# Altium schematic sheet Transducer.SchDoc
size A4; Author: Esteban Durán Madrid; CompanyName: Universidad de Santiago de Chile; Address1: Avenida Ecuador Nº 3519; Address2: Estación Central, Santiago; Address3: Chile; DocumentNumber: 3; SheetNumber: 3; SheetTotal: 3
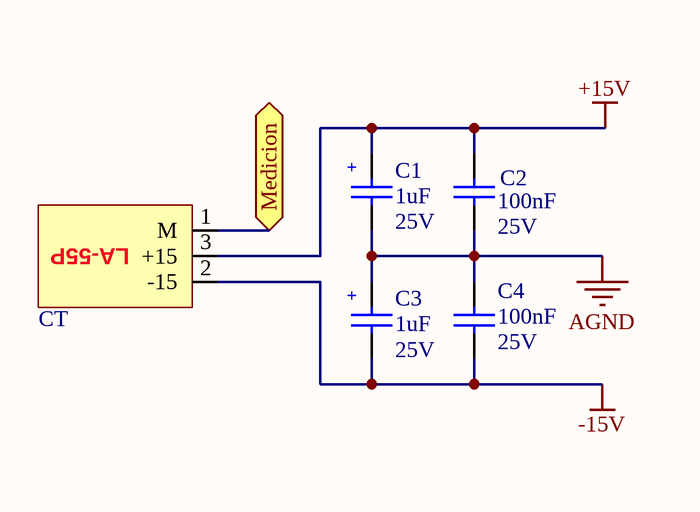
[diagram p0: Transducer.SchDoc]

## Parts
C1  1uF  Voltage: 25V  [CAP_1206 Tantalio]
C2  100nF  Voltage: 25V  [CAP_0805]
C3  1uF  Voltage: 25V  [CAP_1206 Tantalio]
C4  100nF  Voltage: 25V  [CAP_0805]
CT  Current Sensor 50A 1 Channel Hall Effect, Closed Loop Bidirectional Module  [LEM_LA 55-P]  (value not drawn)

## Ports
Medicion

## Nets
+15V: C1.1 C2.1 CT.3(+15)
-15V: C3.2 C4.2 CT.2(-15)
AGND: C1.2 C2.2 C3.1 C4.1
Medicion: CT.1(M) ; port Medicion

## Notes on the sheet
- Title
- Size:
- Date:
- A4
- Revision:
- Time:
- Sheet
- of
- Author:
- Project:
- (in symbol Cap Tantalio 1206) +
- (in symbol LEM_LA 55-P) LA-55P

## Library data of the parts
C1 C3 = Cap Tantalio 1206: Capacitor Tantalio; Manufacturer Part-Number: T491A105K025AT; Digikey Part-Number: 399-3680-1-ND; Value: 1uF
C2 C4 = Cap_0805: Capacitor; Manufacturer Part-Number: C0805C104K3RACTU; Digikey Part-Number: 399-1168-2-ND; Value: 100nF
CT = LEM_LA 55-P: LA 55-P; Manufacturer: LEM USA Inc.; Manufacturer Part-Number: LA 55-P; Digikey Part-Number: 398-1010-ND